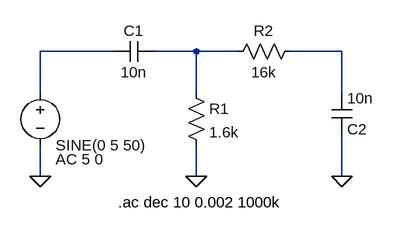
[diagram p0: schematic elecfest-bandpassfilter.asc]
elecfest-bandpassfilter.asc, the LTspice schematic file:
Version 4
SHEET 1 880 680
WIRE 288 272 176 272
WIRE 416 272 352 272
WIRE 480 272 416 272
WIRE 640 272 560 272
WIRE 176 336 176 272
WIRE 416 336 416 272
WIRE 640 336 640 272
WIRE 176 464 176 416
WIRE 416 464 416 416
WIRE 640 464 640 400
FLAG 176 464 0
FLAG 416 464 0
FLAG 640 464 0
SYMBOL Voltage 176 320 R0
WINDOW 0 24 16 Invisible 2
WINDOW 123 24 118 Left 2
SYMATTR InstName V1
SYMATTR Value2 AC 5 0
SYMATTR Value SINE(0 5 50)
SYMBOL Cap 352 256 R90
WINDOW 0 0 32 VBottom 2
WINDOW 3 32 32 VTop 2
SYMATTR InstName C1
SYMATTR Value 10n
SYMBOL Cap 624 336 R0
WINDOW 0 24 56 Left 2
WINDOW 3 24 8 Left 2
SYMATTR InstName C2
SYMATTR Value 10n
SYMBOL Res 400 320 R0
SYMATTR InstName R1
SYMATTR Value 1.6k
SYMBOL Res 576 256 R90
WINDOW 0 0 56 VBottom 2
WINDOW 3 32 56 VTop 2
SYMATTR InstName R2
SYMATTR Value 16k
TEXT 296 504 Left 2 !.ac dec 10 0.002 1000k

The netlist it stands for:
* elecfest-bandpassfilter.asc
V1 N001 0 SINE(0 5 50) AC 5 0
C1 N002 N001 10n
C2 N003 0 10n
R1 N002 0 1.6k
R2 N003 N002 16k
.ac dec 10 0.002 1000k
.backanno
.end